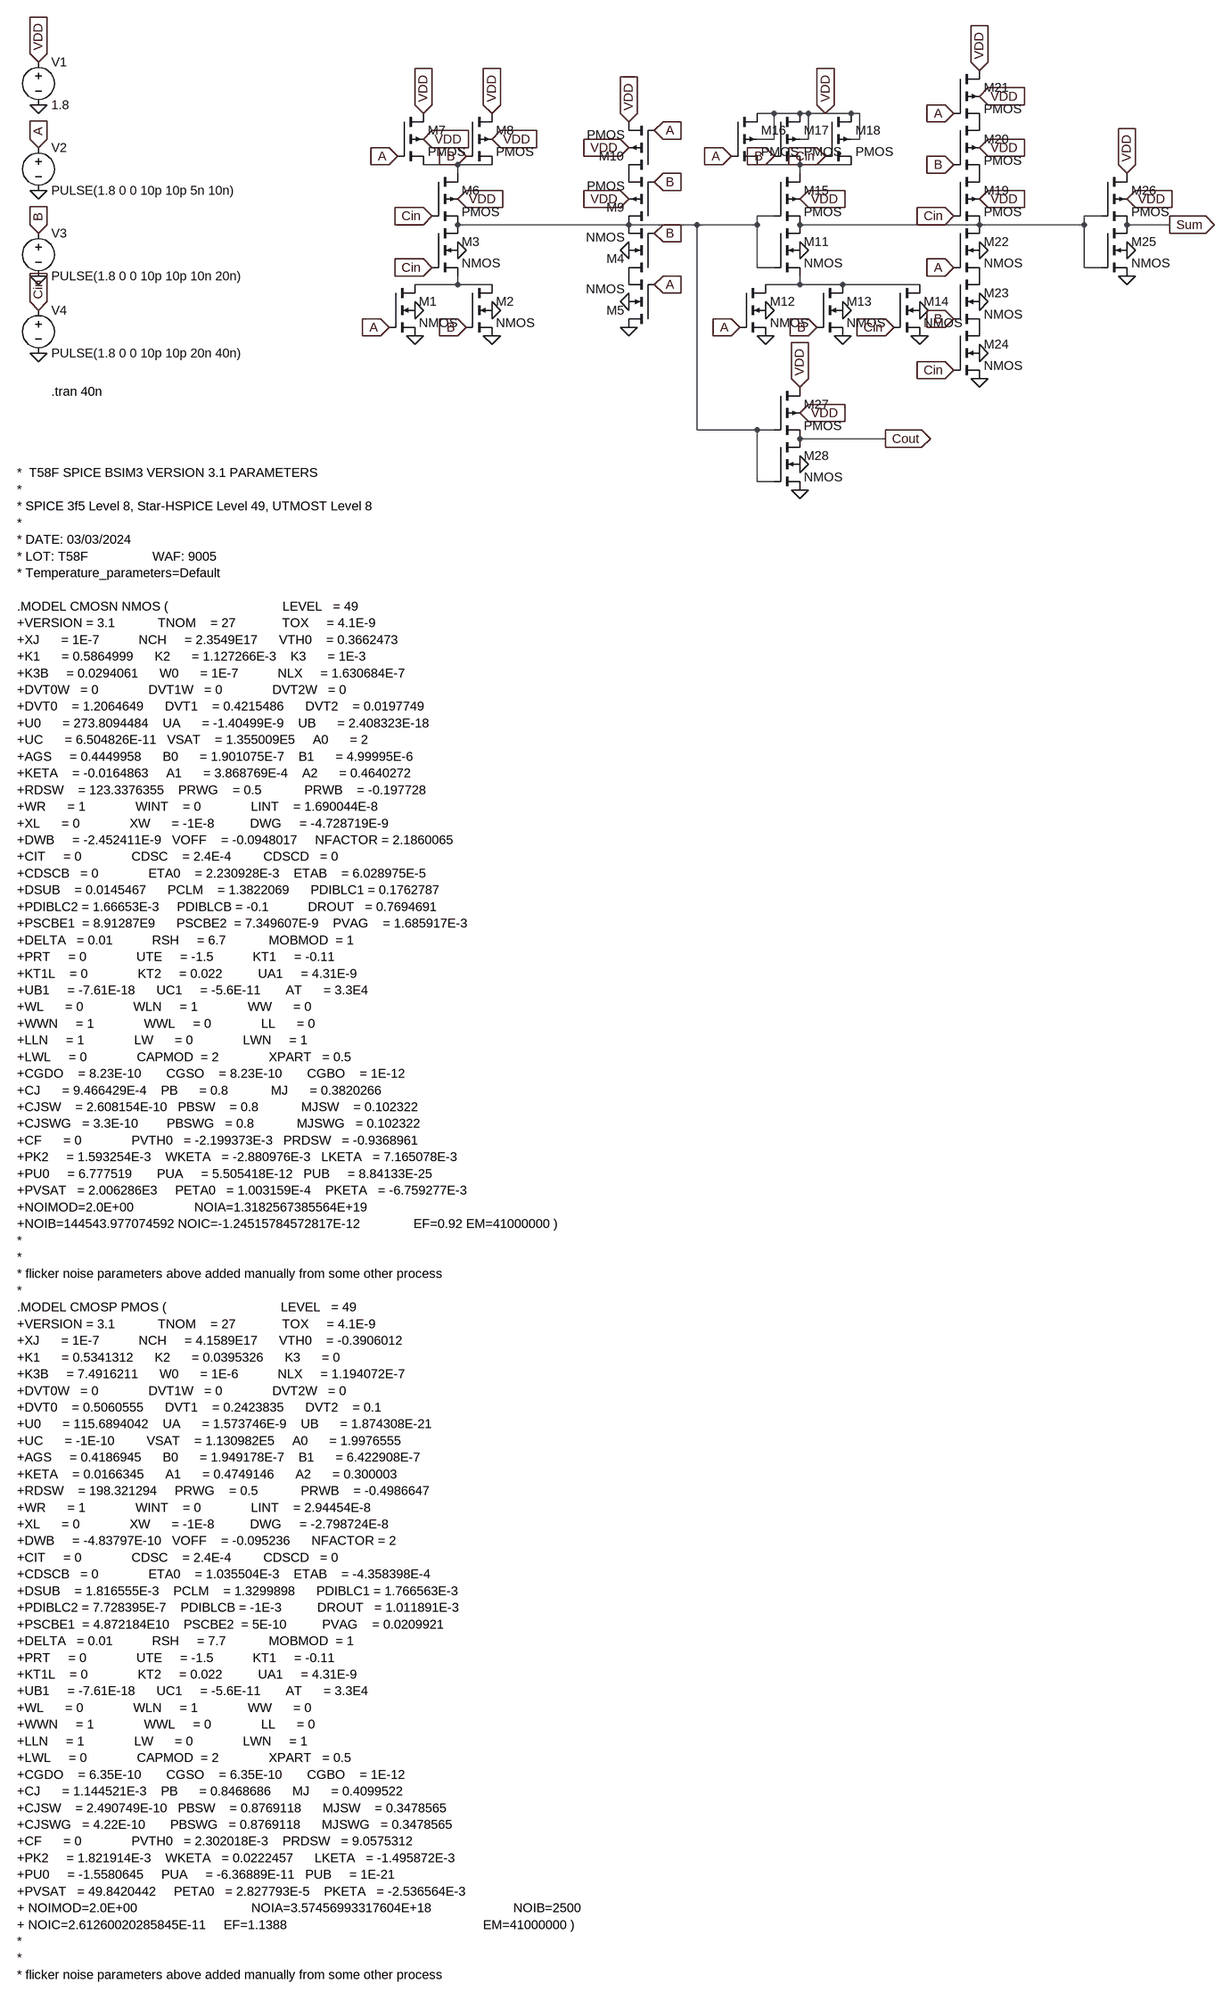
[diagram p0: schematic Draft17.asc]
Draft17.asc, the LTspice schematic file:
Version 4
SHEET 1 1600 3640
WIRE 688 -160 656 -160
WIRE 736 -160 688 -160
WIRE 752 -160 736 -160
WIRE 784 -160 752 -160
WIRE 832 -160 784 -160
WIRE 848 -160 832 -160
WIRE 688 -112 688 -160
WIRE 688 -112 656 -112
WIRE 752 -112 752 -160
WIRE 752 -112 736 -112
WIRE 848 -112 848 -160
WIRE 848 -112 832 -112
WIRE 96 -64 32 -64
WIRE 160 -64 96 -64
WIRE 736 -64 656 -64
WIRE 832 -64 736 -64
WIRE 96 -48 96 -64
WIRE 736 -48 736 -64
WIRE 688 32 656 32
WIRE 1360 32 1328 32
WIRE 416 48 96 48
WIRE 544 48 416 48
WIRE 656 48 656 32
WIRE 656 48 544 48
WIRE 1072 48 736 48
WIRE 1328 48 1328 32
WIRE 1328 48 1072 48
WIRE 1488 48 1408 48
WIRE 656 128 656 48
WIRE 688 128 656 128
WIRE 1328 128 1328 48
WIRE 1360 128 1328 128
WIRE 96 160 96 144
WIRE 96 160 16 160
WIRE 160 160 96 160
WIRE 736 160 736 144
WIRE 736 160 672 160
WIRE 816 160 736 160
WIRE 960 160 816 160
WIRE 544 432 544 48
WIRE 656 432 544 432
WIRE 688 432 656 432
WIRE 896 448 736 448
WIRE 656 528 656 432
WIRE 688 528 656 528
FLAG 416 240 0
FLAG 160 256 0
FLAG 16 256 0
FLAG 16 208 0
FLAG 160 208 0
FLAG 416 192 0
FLAG 416 96 0
FLAG 96 96 0
FLAG -32 240 A
IOPIN -32 240 In
FLAG 464 160 A
IOPIN 464 160 In
FLAG 112 240 B
IOPIN 112 240 In
FLAG 464 64 B
IOPIN 464 64 In
FLAG 48 128 Cin
IOPIN 48 128 In
FLAG 160 -160 VDD
IOPIN 160 -160 In
FLAG 32 -160 VDD
IOPIN 32 -160 In
FLAG 32 -112 VDD
IOPIN 32 -112 In
FLAG 160 -112 VDD
IOPIN 160 -112 In
FLAG 96 0 VDD
IOPIN 96 0 In
FLAG -16 -80 A
IOPIN -16 -80 In
FLAG 416 -96 VDD
IOPIN 416 -96 In
FLAG 416 0 VDD
IOPIN 416 0 In
FLAG 416 -144 VDD
IOPIN 416 -144 In
FLAG 112 -80 B
IOPIN 112 -80 In
FLAG 464 -32 B
IOPIN 464 -32 In
FLAG 464 -128 A
IOPIN 464 -128 In
FLAG 48 32 Cin
IOPIN 48 32 In
FLAG 672 208 0
FLAG 816 208 0
FLAG 960 208 0
FLAG 736 96 0
FLAG 672 256 0
FLAG 816 256 0
FLAG 960 256 0
FLAG 784 -160 VDD
IOPIN 784 -160 In
FLAG 736 0 VDD
IOPIN 736 0 In
FLAG 608 -80 A
IOPIN 608 -80 In
FLAG 624 240 A
IOPIN 624 240 In
FLAG 688 -80 B
IOPIN 688 -80 In
FLAG 768 240 B
IOPIN 768 240 In
FLAG 912 240 Cin
IOPIN 912 240 In
FLAG 784 -80 Cin
IOPIN 784 -80 In
FLAG 1072 -240 VDD
IOPIN 1072 -240 In
FLAG 1072 -192 VDD
IOPIN 1072 -192 In
FLAG 1072 -96 VDD
IOPIN 1072 -96 In
FLAG 1072 0 VDD
IOPIN 1072 0 In
FLAG 1072 336 0
FLAG 1072 288 0
FLAG 1072 192 0
FLAG 1072 96 0
FLAG 1024 -160 A
IOPIN 1024 -160 In
FLAG 1024 128 A
IOPIN 1024 128 In
FLAG 1024 224 B
IOPIN 1024 224 In
FLAG 1024 -64 B
IOPIN 1024 -64 In
FLAG 1024 32 Cin
IOPIN 1024 32 In
FLAG 1024 320 Cin
IOPIN 1024 320 In
FLAG 1408 -48 VDD
IOPIN 1408 -48 In
FLAG 1408 0 VDD
IOPIN 1408 0 In
FLAG 1408 144 0
FLAG 1408 96 0
FLAG 736 544 0
FLAG 736 496 0
FLAG 736 352 VDD
IOPIN 736 352 In
FLAG 736 400 VDD
IOPIN 736 400 In
FLAG 1488 48 Sum
IOPIN 1488 48 Out
FLAG 896 448 Cout
IOPIN 896 448 Out
FLAG -688 -176 0
FLAG -688 -16 0
FLAG -688 144 0
FLAG -688 288 0
FLAG -688 -256 VDD
IOPIN -688 -256 In
FLAG -688 -96 A
IOPIN -688 -96 In
FLAG -688 64 B
IOPIN -688 64 In
FLAG -688 208 Cin
IOPIN -688 208 In
SYMBOL nmos4 -32 160 R0
SYMATTR InstName M1
SYMATTR Value2 l=0.18u w=0.36u
SYMBOL nmos4 112 160 R0
SYMATTR InstName M2
SYMATTR Value2 l=0.18u w=0.36u
SYMBOL nmos4 48 48 R0
SYMATTR InstName M3
SYMATTR Value2 l=0.18u w=0.36u
SYMBOL nmos4 464 144 R180
SYMATTR InstName M4
SYMATTR Value2 l=0.18u w=0.36u
SYMBOL nmos4 464 240 R180
SYMATTR InstName M5
SYMATTR Value2 l=0.18u w=0.36u
SYMBOL pmos4 48 -48 R0
SYMATTR InstName M6
SYMATTR Value2 l=0.18u w=0.72u
SYMBOL pmos4 -16 -160 R0
SYMATTR InstName M7
SYMATTR Value2 l=0.18u w=0.72u
SYMBOL pmos4 112 -160 R0
SYMATTR InstName M8
SYMATTR Value2 l=0.18u w=0.72u
SYMBOL pmos4 464 48 R180
SYMATTR InstName M9
SYMATTR Value2 l=0.18u w=0.72u
SYMBOL pmos4 464 -48 R180
SYMATTR InstName M10
SYMATTR Value2 l=0.18u w=0.72u
SYMBOL nmos4 688 48 R0
SYMATTR InstName M11
SYMATTR Value2 l=0.18u w=0.36u
SYMBOL nmos4 624 160 R0
SYMATTR InstName M12
SYMATTR Value2 l=0.18u w=0.36u
SYMBOL nmos4 768 160 R0
SYMATTR InstName M13
SYMATTR Value2 l=0.18u w=0.36u
SYMBOL nmos4 912 160 R0
SYMATTR InstName M14
SYMATTR Value2 l=0.18u w=0.36u
SYMBOL pmos4 688 -48 R0
SYMATTR InstName M15
SYMATTR Value2 l=0.18u w=0.72u
SYMBOL pmos4 608 -160 R0
SYMATTR InstName M16
SYMATTR Value2 l=0.18u w=0.72u
SYMBOL pmos4 688 -160 R0
SYMATTR InstName M17
SYMATTR Value2 l=0.18u w=0.72u
SYMBOL pmos4 784 -160 R0
SYMATTR InstName M18
SYMATTR Value2 l=0.18u w=0.72u
SYMBOL pmos4 1024 -48 R0
SYMATTR InstName M19
SYMATTR Value2 l=0.18u w=1.08u
SYMBOL pmos4 1024 -144 R0
SYMATTR InstName M20
SYMATTR Value2 l=0.18u w=1.08u
SYMBOL pmos4 1024 -240 R0
SYMATTR InstName M21
SYMATTR Value2 l=0.18u w=1.08u
SYMBOL nmos4 1024 48 R0
SYMATTR InstName M22
SYMATTR Value2 l=0.18u w=0.54u
SYMBOL nmos4 1024 144 R0
SYMATTR InstName M23
SYMATTR Value2 l=0.18u w=0.54u
SYMBOL nmos4 1024 240 R0
SYMATTR InstName M24
SYMATTR Value2 l=0.18u w=0.54u
SYMBOL nmos4 1360 48 R0
SYMATTR InstName M25
SYMATTR Value2 l=0.18u w=0.36u
SYMBOL pmos4 1360 -48 R0
SYMATTR InstName M26
SYMATTR Value2 l=0.18u w=0.72u
SYMBOL pmos4 688 352 R0
SYMATTR InstName M27
SYMATTR Value2 l=0.18u w=0.72u
SYMBOL nmos4 688 448 R0
SYMATTR InstName M28
SYMATTR Value2 l=0.18u w=0.36u
SYMBOL voltage -688 -272 R0
WINDOW 123 0 0 Left 0
WINDOW 39 0 0 Left 0
SYMATTR InstName V1
SYMATTR Value 1.8
SYMBOL voltage -688 -112 R0
WINDOW 123 0 0 Left 0
WINDOW 39 0 0 Left 0
SYMATTR InstName V2
SYMATTR Value PULSE(1.8 0 0 10p 10p 5n 10n)
SYMBOL voltage -688 48 R0
WINDOW 123 0 0 Left 0
WINDOW 39 0 0 Left 0
SYMATTR InstName V3
SYMATTR Value PULSE(1.8 0 0 10p 10p 10n 20n)
SYMBOL voltage -688 192 R0
WINDOW 123 0 0 Left 0
WINDOW 39 0 0 Left 0
SYMATTR InstName V4
SYMATTR Value PULSE(1.8 0 0 10p 10p 20n 40n)
TEXT -664 360 Left 2 !.tran 40n
TEXT -728 512 Left 2 !*  T58F SPICE BSIM3 VERSION 3.1 PARAMETERS\n* \n* SPICE 3f5 Level 8, Star-HSPICE Level 49, UTMOST Level 8\n* \n* DATE: 03/03/2024\n* LOT: T58F                  WAF: 9005\n* Temperature_parameters=Default\n \n.MODEL CMOSN NMOS (                                LEVEL   = 49\n+VERSION = 3.1            TNOM    = 27             TOX     = 4.1E-9\n+XJ      = 1E-7           NCH     = 2.3549E17      VTH0    = 0.3662473\n+K1      = 0.5864999      K2      = 1.127266E-3    K3      = 1E-3\n+K3B     = 0.0294061      W0      = 1E-7           NLX     = 1.630684E-7\n+DVT0W   = 0              DVT1W   = 0              DVT2W   = 0\n+DVT0    = 1.2064649      DVT1    = 0.4215486      DVT2    = 0.0197749\n+U0      = 273.8094484    UA      = -1.40499E-9    UB      = 2.408323E-18\n+UC      = 6.504826E-11   VSAT    = 1.355009E5     A0      = 2\n+AGS     = 0.4449958      B0      = 1.901075E-7    B1      = 4.99995E-6\n+KETA    = -0.0164863     A1      = 3.868769E-4    A2      = 0.4640272\n+RDSW    = 123.3376355    PRWG    = 0.5            PRWB    = -0.197728\n+WR      = 1              WINT    = 0              LINT    = 1.690044E-8\n+XL      = 0              XW      = -1E-8          DWG     = -4.728719E-9\n+DWB     = -2.452411E-9   VOFF    = -0.0948017     NFACTOR = 2.1860065\n+CIT     = 0              CDSC    = 2.4E-4         CDSCD   = 0\n+CDSCB   = 0              ETA0    = 2.230928E-3    ETAB    = 6.028975E-5\n+DSUB    = 0.0145467      PCLM    = 1.3822069      PDIBLC1 = 0.1762787\n+PDIBLC2 = 1.66653E-3     PDIBLCB = -0.1           DROUT   = 0.7694691\n+PSCBE1  = 8.91287E9      PSCBE2  = 7.349607E-9    PVAG    = 1.685917E-3\n+DELTA   = 0.01           RSH     = 6.7            MOBMOD  = 1\n+PRT     = 0              UTE     = -1.5           KT1     = -0.11\n+KT1L    = 0              KT2     = 0.022          UA1     = 4.31E-9\n+UB1     = -7.61E-18      UC1     = -5.6E-11       AT      = 3.3E4\n+WL      = 0              WLN     = 1              WW      = 0\n+WWN     = 1              WWL     = 0              LL      = 0\n+LLN     = 1              LW      = 0              LWN     = 1\n+LWL     = 0              CAPMOD  = 2              XPART   = 0.5\n+CGDO    = 8.23E-10       CGSO    = 8.23E-10       CGBO    = 1E-12\n+CJ      = 9.466429E-4    PB      = 0.8            MJ      = 0.3820266\n+CJSW    = 2.608154E-10   PBSW    = 0.8            MJSW    = 0.102322\n+CJSWG   = 3.3E-10        PBSWG   = 0.8            MJSWG   = 0.102322\n+CF      = 0              PVTH0   = -2.199373E-3   PRDSW   = -0.9368961\n+PK2     = 1.593254E-3    WKETA   = -2.880976E-3   LKETA   = 7.165078E-3\n+PU0     = 6.777519       PUA     = 5.505418E-12   PUB     = 8.84133E-25\n+PVSAT   = 2.006286E3     PETA0   = 1.003159E-4    PKETA   = -6.759277E-3\n+NOIMOD=2.0E+00                 NOIA=1.3182567385564E+19\n+NOIB=144543.977074592 NOIC=-1.24515784572817E-12               EF=0.92 EM=41000000 )\n*\n*\n* flicker noise parameters above added manually from some other process\n* \n.MODEL CMOSP PMOS (                                LEVEL   = 49\n+VERSION = 3.1            TNOM    = 27             TOX     = 4.1E-9\n+XJ      = 1E-7           NCH     = 4.1589E17      VTH0    = -0.3906012\n+K1      = 0.5341312      K2      = 0.0395326      K3      = 0\n+K3B     = 7.4916211      W0      = 1E-6           NLX     = 1.194072E-7\n+DVT0W   = 0              DVT1W   = 0              DVT2W   = 0\n+DVT0    = 0.5060555      DVT1    = 0.2423835      DVT2    = 0.1\n+U0      = 115.6894042    UA      = 1.573746E-9    UB      = 1.874308E-21\n+UC      = -1E-10         VSAT    = 1.130982E5     A0      = 1.9976555\n+AGS     = 0.4186945      B0      = 1.949178E-7    B1      = 6.422908E-7\n+KETA    = 0.0166345      A1      = 0.4749146      A2      = 0.300003\n+RDSW    = 198.321294     PRWG    = 0.5            PRWB    = -0.4986647\n+WR      = 1              WINT    = 0              LINT    = 2.94454E-8\n+XL      = 0              XW      = -1E-8          DWG     = -2.798724E-8\n+DWB     = -4.83797E-10   VOFF    = -0.095236      NFACTOR = 2\n+CIT     = 0              CDSC    = 2.4E-4         CDSCD   = 0\n+CDSCB   = 0              ETA0    = 1.035504E-3    ETAB    = -4.358398E-4\n+DSUB    = 1.816555E-3    PCLM    = 1.3299898      PDIBLC1 = 1.766563E-3\n+PDIBLC2 = 7.728395E-7    PDIBLCB = -1E-3          DROUT   = 1.011891E-3\n+PSCBE1  = 4.872184E10    PSCBE2  = 5E-10          PVAG    = 0.0209921\n+DELTA   = 0.01           RSH     = 7.7            MOBMOD  = 1\n+PRT     = 0              UTE     = -1.5           KT1     = -0.11\n+KT1L    = 0              KT2     = 0.022          UA1     = 4.31E-9\n+UB1     = -7.61E-18      UC1     = -5.6E-11       AT      = 3.3E4\n+WL      = 0              WLN     = 1              WW      = 0\n+WWN     = 1              WWL     = 0              LL      = 0\n+LLN     = 1              LW      = 0              LWN     = 1\n+LWL     = 0              CAPMOD  = 2              XPART   = 0.5\n+CGDO    = 6.35E-10       CGSO    = 6.35E-10       CGBO    = 1E-12\n+CJ      = 1.144521E-3    PB      = 0.8468686      MJ      = 0.4099522\n+CJSW    = 2.490749E-10   PBSW    = 0.8769118      MJSW    = 0.3478565\n+CJSWG   = 4.22E-10       PBSWG   = 0.8769118      MJSWG   = 0.3478565\n+CF      = 0              PVTH0   = 2.302018E-3    PRDSW   = 9.0575312\n+PK2     = 1.821914E-3    WKETA   = 0.0222457      LKETA   = -1.495872E-3\n+PU0     = -1.5580645     PUA     = -6.36889E-11   PUB     = 1E-21\n+PVSAT   = 49.8420442     PETA0   = 2.827793E-5    PKETA   = -2.536564E-3 \n+ NOIMOD=2.0E+00                                NOIA=3.57456993317604E+18                       NOIB=2500\n+ NOIC=2.61260020285845E-11     EF=1.1388                                                       EM=41000000 )\n*\n*\n* flicker noise parameters above added manually from some other process

The netlist it stands for:
* Draft17.asc
M1 N005 A 0 0 NMOS l=0.18u w=0.36u
M2 N005 B 0 0 NMOS l=0.18u w=0.36u
M3 N003 Cin N005 0 NMOS l=0.18u w=0.36u
M4 P001 B N003 0 NMOS l=0.18u w=0.36u
M5 0 A P001 0 NMOS l=0.18u w=0.36u
M6 N001 Cin N003 VDD PMOS l=0.18u w=0.72u
M7 VDD A N001 VDD PMOS l=0.18u w=0.72u
M8 VDD B N001 VDD PMOS l=0.18u w=0.72u
M9 N003 B P002 VDD PMOS l=0.18u w=0.72u
M10 P002 A VDD VDD PMOS l=0.18u w=0.72u
M11 N004 N003 N006 0 NMOS l=0.18u w=0.36u
M12 N006 A 0 0 NMOS l=0.18u w=0.36u
M13 N006 B 0 0 NMOS l=0.18u w=0.36u
M14 N006 Cin 0 0 NMOS l=0.18u w=0.36u
M15 N002 N003 N004 VDD PMOS l=0.18u w=0.72u
M16 VDD A N002 VDD PMOS l=0.18u w=0.72u
M17 VDD B N002 VDD PMOS l=0.18u w=0.72u
M18 VDD Cin N002 VDD PMOS l=0.18u w=0.72u
M19 P003 Cin N004 VDD PMOS l=0.18u w=1.08u
M20 P004 B P003 VDD PMOS l=0.18u w=1.08u
M21 VDD A P004 VDD PMOS l=0.18u w=1.08u
M22 N004 A P005 0 NMOS l=0.18u w=0.54u
M23 P005 B P006 0 NMOS l=0.18u w=0.54u
M24 P006 Cin 0 0 NMOS l=0.18u w=0.54u
M25 Sum N004 0 0 NMOS l=0.18u w=0.36u
M26 VDD N004 Sum VDD PMOS l=0.18u w=0.72u
M27 VDD N003 Cout VDD PMOS l=0.18u w=0.72u
M28 Cout N003 0 0 NMOS l=0.18u w=0.36u
V1 VDD 0 1.8
V2 A 0 PULSE(1.8 0 0 10p 10p 5n 10n)
V3 B 0 PULSE(1.8 0 0 10p 10p 10n 20n)
V4 Cin 0 PULSE(1.8 0 0 10p 10p 20n 40n)
.model NMOS NMOS
.model PMOS PMOS
.lib standard.mos
.tran 40n
*  T58F SPICE BSIM3 VERSION 3.1 PARAMETERS
*
* SPICE 3f5 Level 8, Star-HSPICE Level 49, UTMOST Level 8
*
* DATE: 03/03/2024
* LOT: T58F                  WAF: 9005
* Temperature_parameters=Default
.MODEL CMOSN NMOS (                                LEVEL   = 49
+VERSION = 3.1            TNOM    = 27             TOX     = 4.1E-9
+XJ      = 1E-7           NCH     = 2.3549E17      VTH0    = 0.3662473
+K1      = 0.5864999      K2      = 1.127266E-3    K3      = 1E-3
+K3B     = 0.0294061      W0      = 1E-7           NLX     = 1.630684E-7
+DVT0W   = 0              DVT1W   = 0              DVT2W   = 0
+DVT0    = 1.2064649      DVT1    = 0.4215486      DVT2    = 0.0197749
+U0      = 273.8094484    UA      = -1.40499E-9    UB      = 2.408323E-18
+UC      = 6.504826E-11   VSAT    = 1.355009E5     A0      = 2
+AGS     = 0.4449958      B0      = 1.901075E-7    B1      = 4.99995E-6
+KETA    = -0.0164863     A1      = 3.868769E-4    A2      = 0.4640272
+RDSW    = 123.3376355    PRWG    = 0.5            PRWB    = -0.197728
+WR      = 1              WINT    = 0              LINT    = 1.690044E-8
+XL      = 0              XW      = -1E-8          DWG     = -4.728719E-9
+DWB     = -2.452411E-9   VOFF    = -0.0948017     NFACTOR = 2.1860065
+CIT     = 0              CDSC    = 2.4E-4         CDSCD   = 0
+CDSCB   = 0              ETA0    = 2.230928E-3    ETAB    = 6.028975E-5
+DSUB    = 0.0145467      PCLM    = 1.3822069      PDIBLC1 = 0.1762787
+PDIBLC2 = 1.66653E-3     PDIBLCB = -0.1           DROUT   = 0.7694691
+PSCBE1  = 8.91287E9      PSCBE2  = 7.349607E-9    PVAG    = 1.685917E-3
+DELTA   = 0.01           RSH     = 6.7            MOBMOD  = 1
+PRT     = 0              UTE     = -1.5           KT1     = -0.11
+KT1L    = 0              KT2     = 0.022          UA1     = 4.31E-9
+UB1     = -7.61E-18      UC1     = -5.6E-11       AT      = 3.3E4
+WL      = 0              WLN     = 1              WW      = 0
+WWN     = 1              WWL     = 0              LL      = 0
+LLN     = 1              LW      = 0              LWN     = 1
+LWL     = 0              CAPMOD  = 2              XPART   = 0.5
+CGDO    = 8.23E-10       CGSO    = 8.23E-10       CGBO    = 1E-12
+CJ      = 9.466429E-4    PB      = 0.8            MJ      = 0.3820266
+CJSW    = 2.608154E-10   PBSW    = 0.8            MJSW    = 0.102322
+CJSWG   = 3.3E-10        PBSWG   = 0.8            MJSWG   = 0.102322
+CF      = 0              PVTH0   = -2.199373E-3   PRDSW   = -0.9368961
+PK2     = 1.593254E-3    WKETA   = -2.880976E-3   LKETA   = 7.165078E-3
+PU0     = 6.777519       PUA     = 5.505418E-12   PUB     = 8.84133E-25
+PVSAT   = 2.006286E3     PETA0   = 1.003159E-4    PKETA   = -6.759277E-3
+NOIMOD=2.0E+00                 NOIA=1.3182567385564E+19
+NOIB=144543.977074592 NOIC=-1.24515784572817E-12               EF=0.92 EM=41000000 )
*
*
* flicker noise parameters above added manually from some other process
*
.MODEL CMOSP PMOS (                                LEVEL   = 49
+VERSION = 3.1            TNOM    = 27             TOX     = 4.1E-9
+XJ      = 1E-7           NCH     = 4.1589E17      VTH0    = -0.3906012
+K1      = 0.5341312      K2      = 0.0395326      K3      = 0
+K3B     = 7.4916211      W0      = 1E-6           NLX     = 1.194072E-7
+DVT0W   = 0              DVT1W   = 0              DVT2W   = 0
+DVT0    = 0.5060555      DVT1    = 0.2423835      DVT2    = 0.1
+U0      = 115.6894042    UA      = 1.573746E-9    UB      = 1.874308E-21
+UC      = -1E-10         VSAT    = 1.130982E5     A0      = 1.9976555
+AGS     = 0.4186945      B0      = 1.949178E-7    B1      = 6.422908E-7
+KETA    = 0.0166345      A1      = 0.4749146      A2      = 0.300003
+RDSW    = 198.321294     PRWG    = 0.5            PRWB    = -0.4986647
+WR      = 1              WINT    = 0              LINT    = 2.94454E-8
+XL      = 0              XW      = -1E-8          DWG     = -2.798724E-8
+DWB     = -4.83797E-10   VOFF    = -0.095236      NFACTOR = 2
+CIT     = 0              CDSC    = 2.4E-4         CDSCD   = 0
+CDSCB   = 0              ETA0    = 1.035504E-3    ETAB    = -4.358398E-4
+DSUB    = 1.816555E-3    PCLM    = 1.3299898      PDIBLC1 = 1.766563E-3
+PDIBLC2 = 7.728395E-7    PDIBLCB = -1E-3          DROUT   = 1.011891E-3
+PSCBE1  = 4.872184E10    PSCBE2  = 5E-10          PVAG    = 0.0209921
+DELTA   = 0.01           RSH     = 7.7            MOBMOD  = 1
+PRT     = 0              UTE     = -1.5           KT1     = -0.11
+KT1L    = 0              KT2     = 0.022          UA1     = 4.31E-9
+UB1     = -7.61E-18      UC1     = -5.6E-11       AT      = 3.3E4
+WL      = 0              WLN     = 1              WW      = 0
+WWN     = 1              WWL     = 0              LL      = 0
+LLN     = 1              LW      = 0              LWN     = 1
+LWL     = 0              CAPMOD  = 2              XPART   = 0.5
+CGDO    = 6.35E-10       CGSO    = 6.35E-10       CGBO    = 1E-12
+CJ      = 1.144521E-3    PB      = 0.8468686      MJ      = 0.4099522
+CJSW    = 2.490749E-10   PBSW    = 0.8769118      MJSW    = 0.3478565
+CJSWG   = 4.22E-10       PBSWG   = 0.8769118      MJSWG   = 0.3478565
+CF      = 0              PVTH0   = 2.302018E-3    PRDSW   = 9.0575312
+PK2     = 1.821914E-3    WKETA   = 0.0222457      LKETA   = -1.495872E-3
+PU0     = -1.5580645     PUA     = -6.36889E-11   PUB     = 1E-21
+PVSAT   = 49.8420442     PETA0   = 2.827793E-5    PKETA   = -2.536564E-3
+ NOIMOD=2.0E+00                                NOIA=3.57456993317604E+18                       NOIB=2500
+ NOIC=2.61260020285845E-11     EF=1.1388                                                       EM=41000000 )
*
*
* flicker noise parameters above added manually from some other process
.backanno
.end